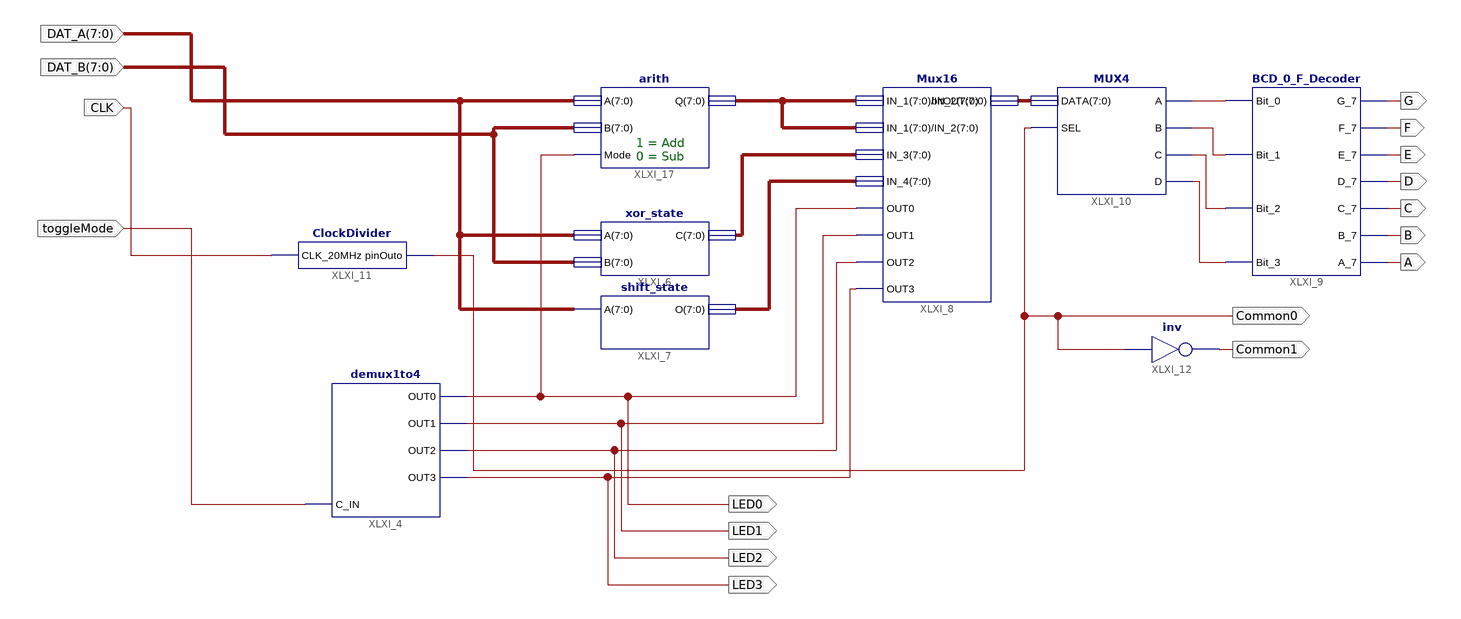
[diagram p0: schematic sheet 1]
// Xilinx ISE schematic alu.sch (spartan6) as structural Verilog: 9 symbols, 17 ports
module alu (
  input  [7:0] DAT_A,
  input  [7:0] DAT_B,
  input  toggleMode,
  input  CLK,
  output G,
  output F,
  output E,
  output D,
  output C,
  output B,
  output A,
  output Common0,
  output Common1,
  output LED0,
  output LED1,
  output LED2,
  output LED3
);

  wire XLXN_50, XLXN_51, XLXN_53, XLXN_54;
  wire [7:0] XLXN_12, XLXN_27, XLXN_29, XLXN_48;

  demux1to4 XLXI_4 (.OUT0(LED0), .OUT1(LED1), .OUT2(LED2), .OUT3(LED3), .C_IN(toggleMode));
  xor_state XLXI_6 (.A(DAT_A), .B(DAT_B), .C(XLXN_27));
  shift_state XLXI_7 (.A(DAT_A), .O(XLXN_29));
  Mux16 XLXI_8 (
    .bitOUT(XLXN_48), .IN_1(XLXN_12), .IN_2(XLXN_12), .IN_3(XLXN_27), .IN_4(XLXN_29), .OUT0(LED0),
    .OUT1(LED1), .OUT2(LED2), .OUT3(LED3));
  BCD_0_F_Decoder XLXI_9 (
    .Bit_0(XLXN_50), .Bit_1(XLXN_51), .Bit_2(XLXN_54), .Bit_3(XLXN_53), .G_7(G), .F_7(F), .E_7(E), .D_7(D),
    .C_7(C), .A_7(A), .B_7(B));
  MUX4 XLXI_10 (.A(XLXN_50), .B(XLXN_51), .C(XLXN_54), .D(XLXN_53), .DATA(XLXN_48), .SEL(Common0));
  ClockDivider XLXI_11 (.CLK_20MHz(CLK), .pinOuto(Common0));
  not XLXI_12 (Common1, Common0);
  arith XLXI_17 (.A(DAT_A), .B(DAT_B), .Mode(LED0), .Q(XLXN_12));

  // Notes on the sheet:
  //   1 = Add
  //   0 = Sub
  //   CLOCK_DEDICATED_ROUTE on signal toggleMode = FALSE
endmodule
